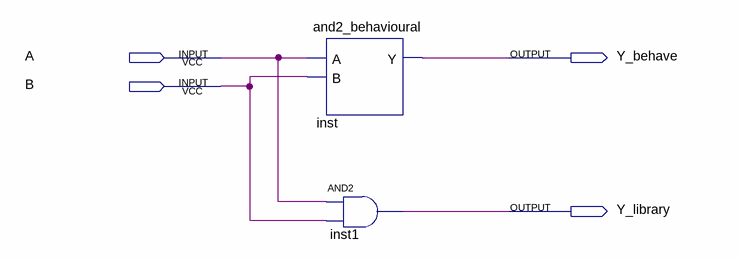
[diagram p0: schematic sheet]
// Quartus schematic behavioural.bdf as structural Verilog: 2 symbols, 4 pins
module behavioural (
  input  A,
  input  B,
  output Y_behave,
  output Y_library
);

  and2_behavioural inst (.A(A), .B(B), .Y(Y_behave));
  and inst1 (Y_library, A, B);
endmodule
